# Altium schematic sheet barGraph.SchDoc
size A4; Organization: Altium Limited; Address1: L3, 12a Rodborough Rd; Address2: Frenchs Forest; Address3: NSW; Address4: Australia 2086; DocumentNumber: 1; SheetNumber: 1; SheetTotal: 3
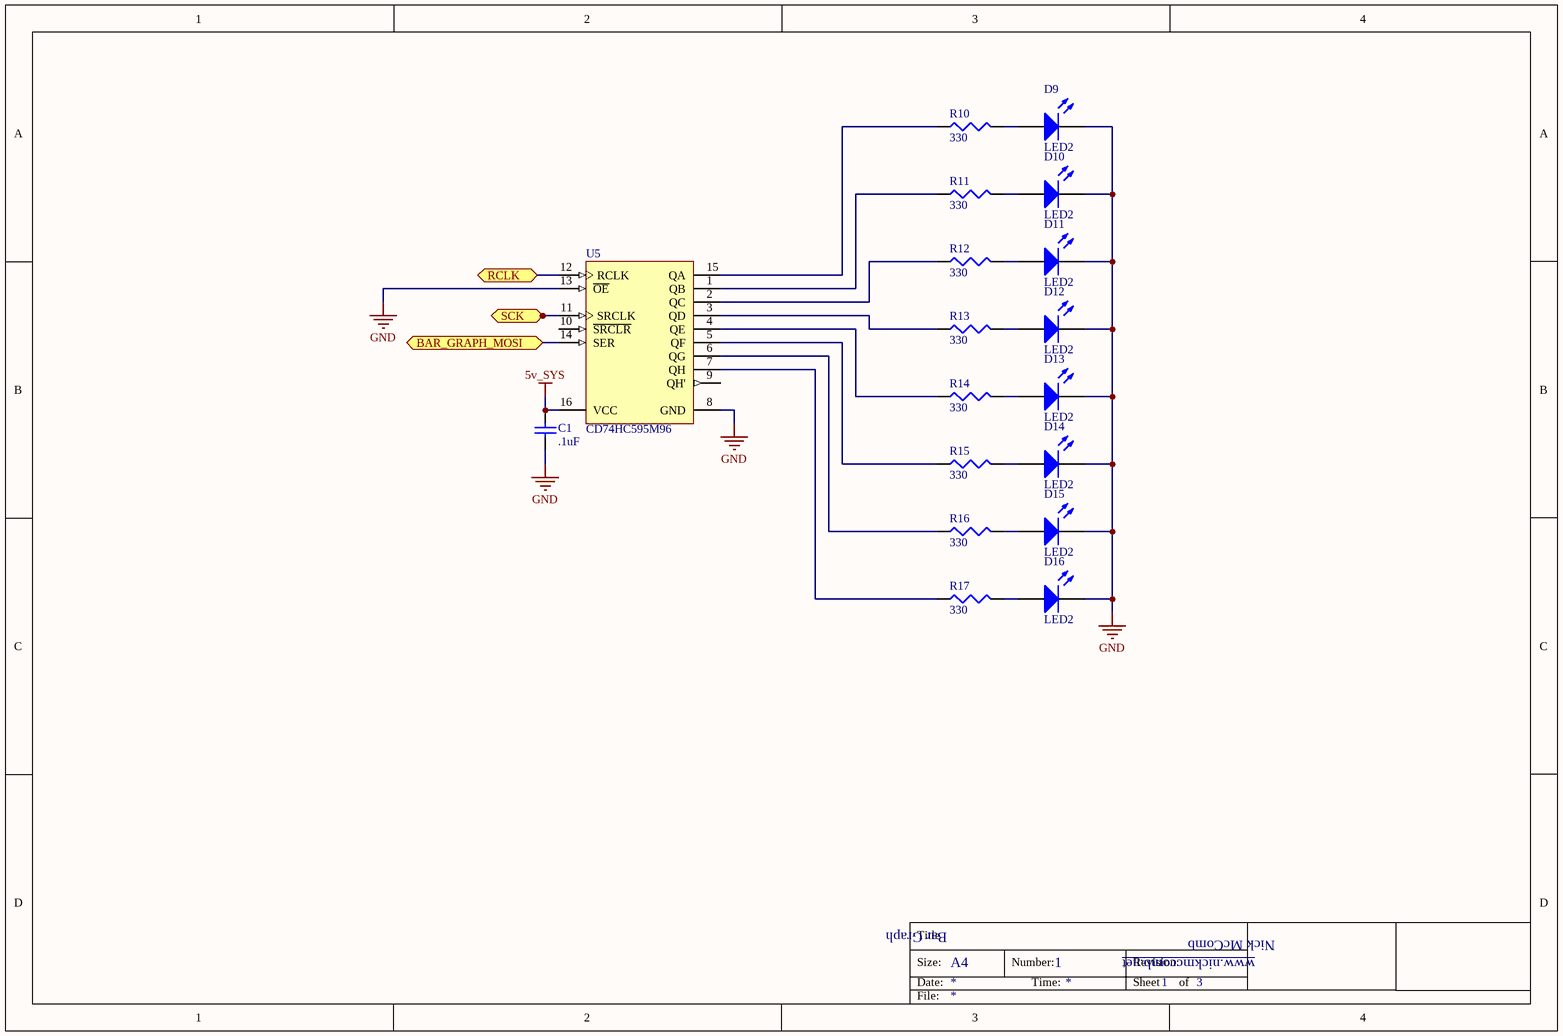
[diagram p0: barGraph.SchDoc]

## Parts
C1  value .1uF  [C0805]  (hidden comment: 0805 style, by default)
D9  LED2  [basic_led]
D10  LED2  [basic_led]
D11  LED2  [basic_led]
D12  LED2  [basic_led]
D13  LED2  [basic_led]
D14  LED2  [basic_led]
D15  LED2  [basic_led]
D16  LED2  [basic_led]
R10  330  [J1-0603]
R11  330  [J1-0603]
R12  330  [J1-0603]
R13  330  [J1-0603]
R14  330  [J1-0603]
R15  330  [J1-0603]
R16  330  [J1-0603]
R17  330  [J1-0603]
U5  CD74HC595M96  [D0016A_L]

## Ports
BAR_GRAPH_MOSI, RCLK, SCK

## Nets
5v_SYS: C1.2 U5.16(VCC)
GND: C1.1 D9.2(K) D10.2(K) D11.2(K) D12.2(K) D13.2(K) D14.2(K) D15.2(K) D16.2(K) U5.8(GND) U5.13(~{OE})
BAR_GRAPH_MOSI: U5.14(SER) ; port BAR_GRAPH_MOSI
RCLK: U5.12(RCLK) ; port RCLK
SCK: U5.11(SRCLK) ; port SCK
NetD9_1: D9.1(A) R10.2
NetD10_1: D10.1(A) R11.2
NetD11_1: D11.1(A) R12.2
NetD12_1: D12.1(A) R13.2
NetD13_1: D13.1(A) R14.2
NetD14_1: D14.1(A) R15.2
NetD15_1: D15.1(A) R16.2
NetD16_1: D16.1(A) R17.2
NetR10_1: R10.1 U5.15(QA)
NetR11_1: R11.1 U5.1(QB)
NetR12_1: R12.1 U5.2(QC)
NetR13_1: R13.1 U5.3(QD)
NetR14_1: R14.1 U5.4(QE)
NetR15_1: R15.1 U5.5(QF)
NetR16_1: R16.1 U5.6(QG)
NetR17_1: R17.1 U5.7(QH)

Not connected (* = marked no-connect by the designer): U5 9(QH') 10(~{SRCLR})

## Notes on the sheet
- Bar Graph
- Title
- Size:
- Date:
- A4
- Number:
- Time:
- Revision:
- Sheet
- of
- www.nickmccomb.net
- Nick McComb
- File:

## Library data of the parts
C1 = Cap: Capacitor; Published: 8-Jun-2000; LatestRevisionDate: 17-Jul-2002; LatestRevisionNote: Re-released for DXP Platform.; PackageReference: RAD-0.3; Publisher: Altium Limited; PackageDescription: Radial Cap, Thru-Hole; 2 Leads; 0.3 in Pin Spacing
D9-D16 = LED2: Typical RED, GREEN, YELLOW, AMBER GaAs LED; Published: 8-Jun-2000; LatestRevisionDate: 17-Jul-2002; LatestRevisionNote: Re-released for DXP Platform.; PackageVersion: Feb-2002; PackageReference: 3.2X1.6X1.1; Publisher: Altium Limited; PackageDescription: SM LED; 2 Flat Leads
R10-R17 = Res3: Resistor; Published: 8-Jun-2000; LatestRevisionDate: 29-May-2009; LatestRevisionNote: IPC-7351 Footprint Added.; PackageReference: J1-0603; Publisher: Altium Limited; PackageDescription: Chip Resistor; Value: 330
U5 = CMP-0807-00025-1: 8-Bit Shift Registers With 3-State Output Registers, D0016A, LARGE T&R; ICC @ Nom Voltage(Max)(mA): 0.08; 3-State Output: Yes; Input Type: CMOS; VCC(Max)(V): 6; Bits: 8; No. of Outputs: 9; VCC(Min)(V): 2; F @ Nom Voltage(Max)(Mhz): 28; Technology Family: HC; tpd @ Nom Voltage(Max)(ns): 41; Output Drive (IOL/IOH)(Max)(mA): 7.8/-7.8; Rating: Catalog; PackageVersion: http://www.ti.com/lit/ml/mpds178g/mpds178g.pdf; Code_IPC: MS-012 variation AC; Operating Temperature Range(C): -55 to 125; ComponentLink2Description: Datasheet; ComponentLink1Description: Manufacturer URL; ComponentLink2URL: http://www.ti.com/lit/ds/symlink/cd74hc595.pdf; PackageReference: D0016A; PartNumber: CD74HC595M96; Part Number: CD74HC595; DatasheetVersion: SCHS353; ComponentLink1URL: http://www.ti.com/; Output Type: CMOS; Voltage(Nom)(V): 6